# EAGLE design final-board (EAGLE 9.6.1)
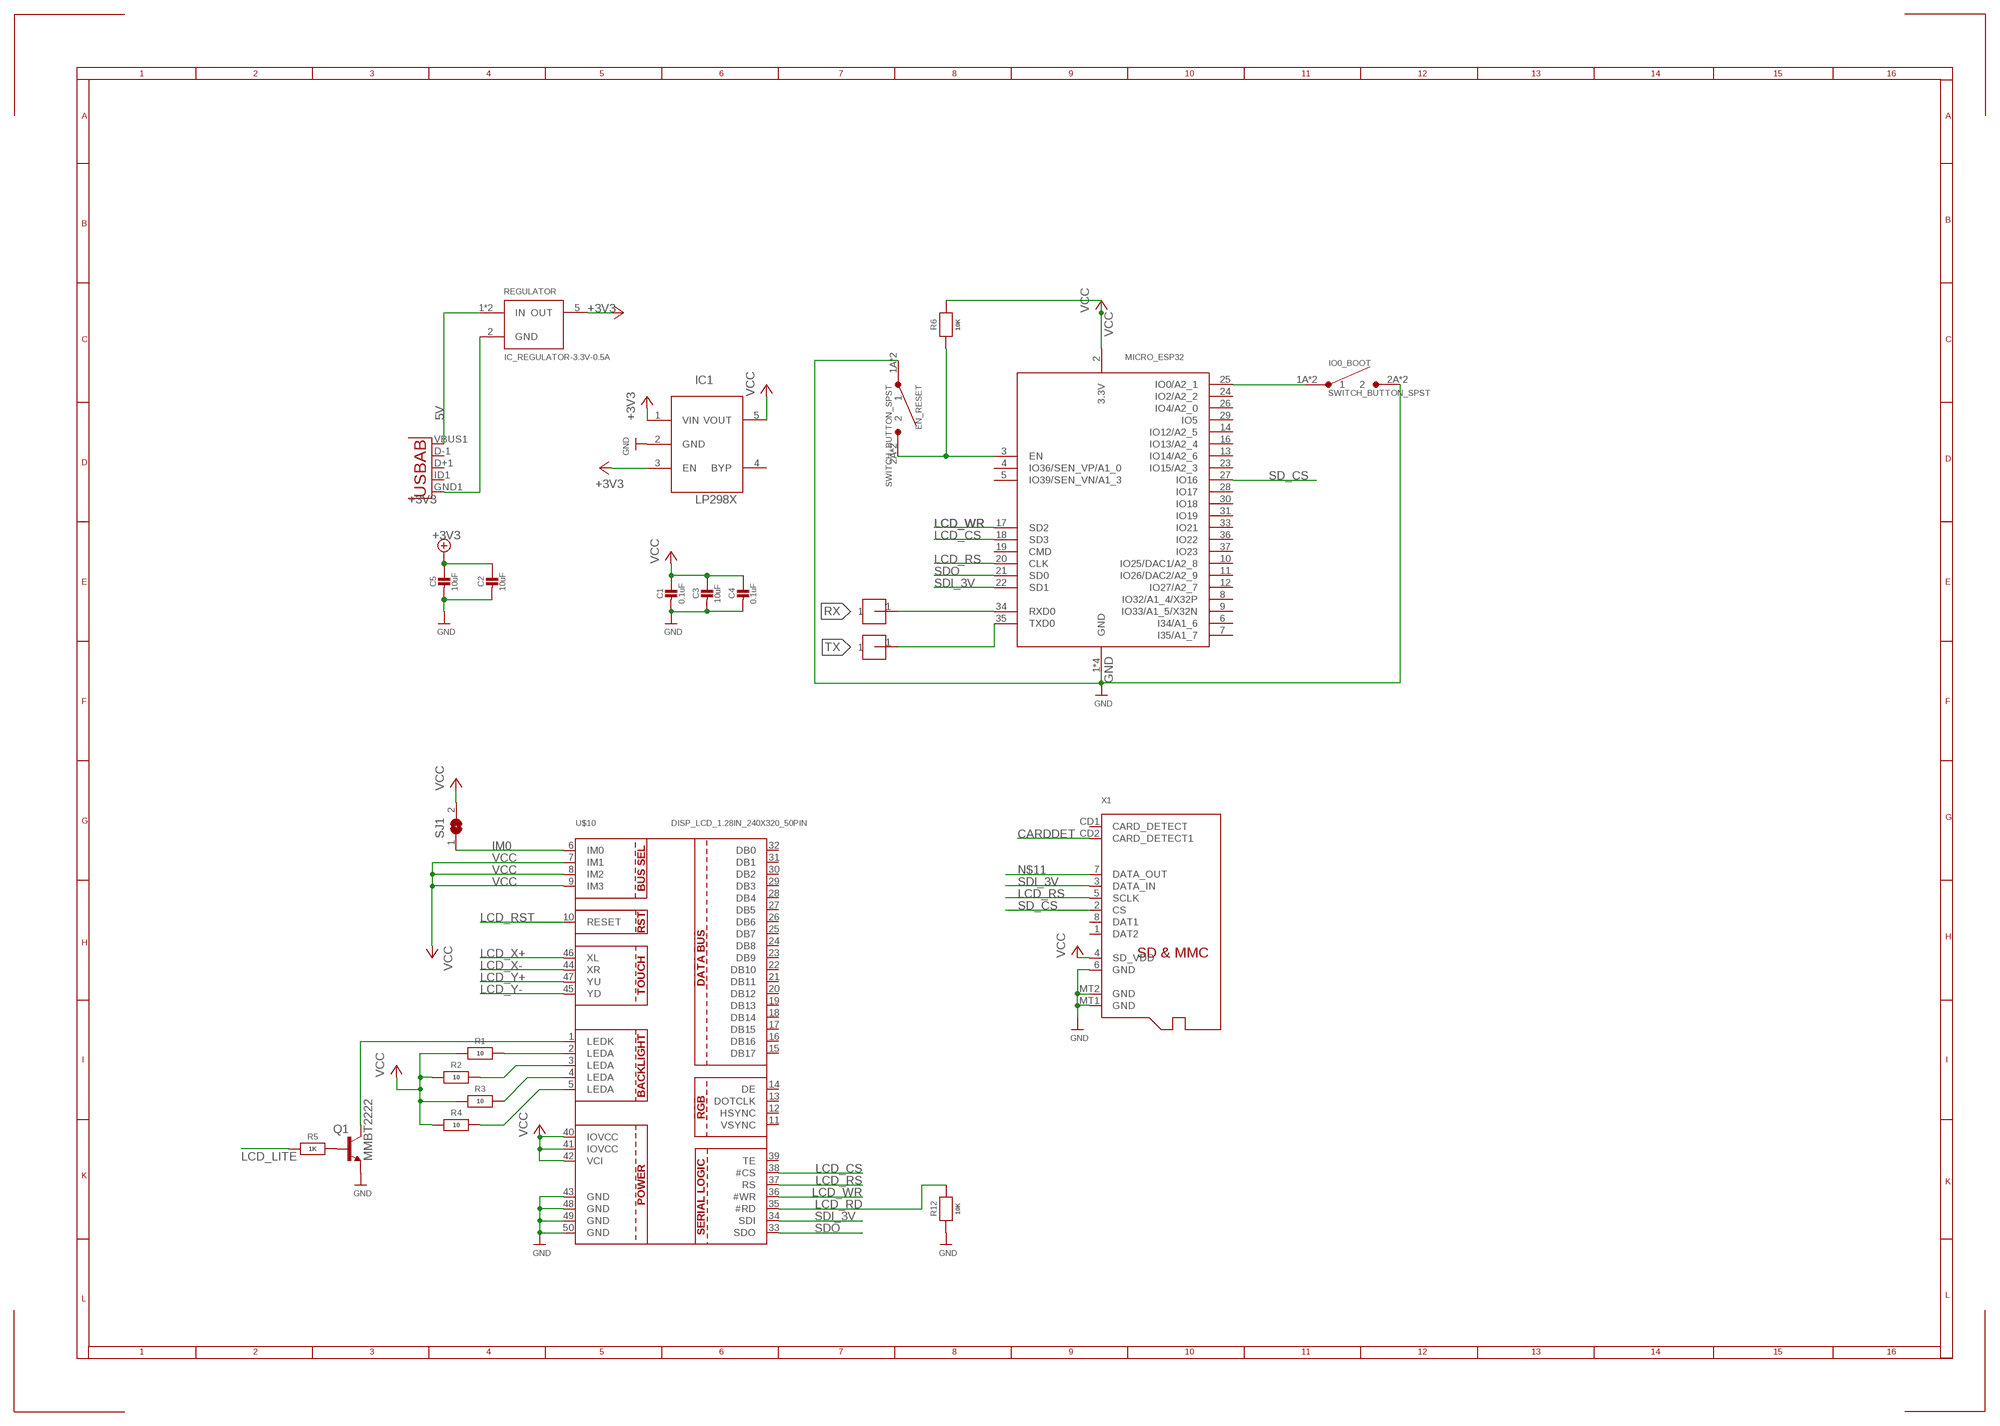
[diagram p0: schematic, sheet 1]

## Parts
C1  0.1uF  CAP_CERAMIC0805-NOOUTLINE  [0805-NO]
C2  10uF  CAP_CERAMIC0805-NOOUTLINE  [0805-NO]
C3  10uF  CAP_CERAMIC0805-NOOUTLINE  [0805-NO]
C4  0.1uF  CAP_CERAMIC0805-NOOUTLINE  [0805-NO]
C5  10uF  CAP_CERAMIC0805-NOOUTLINE  [0805-NO]
EN_RESET  SWITCH_BUTTON_SPST  [7914G-1-000E]
ESP_32  MICRO_ESP32  [WROOM32]
IC1  MIC5225-3.3  LP298XS  [SOT23-5L]
IO0_BOOT  SWITCH_BUTTON_SPST  [7914G-1-000E]
Q1  MMBT2222  MMBT2222ALT1-NPN-SOT23-BEC  [SOT23-BEC]
R1  10  RESISTOR0805_NOOUTLINE  [0805-NO]
R2  10  RESISTOR0805_NOOUTLINE  [0805-NO]
R3  10  RESISTOR0805_NOOUTLINE  [0805-NO]
R4  10  RESISTOR0805_NOOUTLINE  [0805-NO]
R5  1K  RESISTOR0805_NOOUTLINE  [0805-NO]
R6  10K  RESISTOR0805_NOOUTLINE  [0805-NO]
R12  10K  RESISTOR0805_NOOUTLINE  [0805-NO]
REGULATOR  IC_REGULATOR-3.3V-0.5A  [SOT23-5]
SJ1  SOLDERJUMPER  [SOLDERJUMPER_ARROW_NOPASTE]
U$2  HEADER-1-TESTPOINT  [TESTPOINT-1]
U$7  HEADER-1-TESTPOINT  [TESTPOINT-1]
U$10  DISP_LCD_1.28IN_240X320_50PIN  [TFT_2.83IN_240X320_50PIN]
USB  USB""  [USB-MICRO-SMD]
X1  MICROSD  [MICROSD]

## Nets
5V: REGULATOR.1(IN) REGULATOR.3(IN) USB.VBUS1(VBUS)
+3V3: C2.1 C5.1 IC1.1(VIN) IC1.3(EN) REGULATOR.5(OUT) ; supply symbol labelled +5V
CARDDET: X1.CD2(CARD_DETECT1)
GND: C1.2 C2.2 C3.2 C4.2 C5.2 EN_RESET.1A EN_RESET.1B ESP_32.1(GND) ESP_32.15(GND) ESP_32.38(GND) ESP_32.P$1(GND) IC1.2(GND) IO0_BOOT.2A IO0_BOOT.2B Q1.E R12.1 REGULATOR.2(GND) U$10.43(GND) U$10.48(GND) U$10.49(GND) U$10.50(GND) USB.GND1(GND) X1.6(GND) X1.MT1(GND) X1.MT2(GND)
IM0: SJ1.1 U$10.6(IM0)
LCD_CS: ESP_32.18(SD3) U$10.38(#CS)
LCD_LITE: R5.1
LCD_RD: R12.2 U$10.35(#RD)
LCD_RS: ESP_32.20(CLK) U$10.37(RS) X1.5(SCLK)
LCD_RST: U$10.10(RESET)
LCD_WR: ESP_32.17(SD2) U$10.36(#WR)
LCD_X+: U$10.46(XL)
LCD_X-: U$10.44(XR)
LCD_Y+: U$10.47(YU)
LCD_Y-: U$10.45(YD)
N$1: R4.2 U$10.5(LEDA)
N$2: R1.2 U$10.2(LEDA)
N$3: R2.2 U$10.3(LEDA)
N$4: R3.2 U$10.4(LEDA)
N$5: Q1.C U$10.1(LEDK)
N$6: EN_RESET.2A EN_RESET.2B ESP_32.3(EN) R6.1
N$7: ESP_32.25(IO0/A2_1) IO0_BOOT.1A IO0_BOOT.1B
N$11: X1.7(DATA_OUT)
N$16: Q1.B R5.2
RX: ESP_32.34(RXD0) U$2.1
SD_CS: ESP_32.27(IO16) X1.2(CS)
SDI_3V: ESP_32.22(SD1) U$10.34(SDI) X1.3(DATA_IN)
SDO: ESP_32.21(SD0) U$10.33(SDO)
TX: ESP_32.35(TXD0) U$7.1
VCC: C1.1 C3.1 C4.1 ESP_32.2(3.3V) IC1.5(VOUT) R1.1 R2.1 R3.1 R4.1 R6.2 SJ1.2 U$10.7(IM1) U$10.8(IM2) U$10.9(IM3) U$10.40(IOVCC) U$10.41(IOVCC) U$10.42(VCI) X1.4(SD_VDD)
Unconnected: ESP_32.4(IO36/SEN_VP/A1_0) ESP_32.5(IO39/SEN_VN/A1_3) ESP_32.6(I34/A1_6) ESP_32.7(I35/A1_7) ESP_32.8(IO32/A1_4/X32P) ESP_32.9(IO33/A1_5/X32N) ESP_32.10(IO25/DAC1/A2_8) ESP_32.11(IO26/DAC2/A2_9) ESP_32.12(IO27/A2_7) ESP_32.13(IO14/A2_6) ESP_32.14(IO12/A2_5) ESP_32.16(IO13/A2_4) ESP_32.19(CMD) ESP_32.23(IO15/A2_3) ESP_32.24(IO2/A2_2) ESP_32.26(IO4/A2_0) ESP_32.28(IO17) ESP_32.29(IO5) ESP_32.30(IO18) ESP_32.31(IO19) ESP_32.33(IO21) ESP_32.36(IO22) ESP_32.37(IO23) IC1.4(BYP) U$10.11(VSYNC) U$10.12(HSYNC) U$10.13(DOTCLK) U$10.14(DE) U$10.15(DB17) U$10.16(DB16) U$10.17(DB15) U$10.18(DB14) U$10.19(DB13) U$10.20(DB12) U$10.21(DB11) U$10.22(DB10) U$10.23(DB9) U$10.24(DB8) U$10.25(DB7) U$10.26(DB6) U$10.27(DB5) U$10.28(DB4) U$10.29(DB3) U$10.30(DB2) U$10.31(DB1) U$10.32(DB0) U$10.39(TE) USB.D+1(D+) USB.D-1(D-) USB.ID1(USBID) X1.1(DAT2) X1.8(DAT1) X1.CD1(CARD_DETECT)

## Library data of the parts
C1-C5 = microbuilder:CAP_CERAMIC: Ceramic Capacitors For new designs, use the packages preceded by an '_' character since they are more reliable: The following footprints should be used on most boards: _0402 - Standard footprint for regular board layouts _0603 - Standard footprint for regular board layouts _0805 - Standard footprint for regular board layouts _1206 - Standard footprint for regular board layouts For extremely tight-pitch boards where space is at a premium, the following 'micro-pitch' footprints can be used (smaller pads, no silkscreen outline, etc.): _0402MP - Micro-pitch footprint for very dense/compact boards _0603MP - Micro-pitch footprint for very dense/compact boards _0805MP - Micro-pitch footprint for very dense/compact boards _1206MP - Micro-pitch footprint for very dense/compact boards
EN_RESET IO0_BOOT = homemade-hardware:SWITCH_BUTTON_SPST: 7914G-1-000E <https://www.digikey.com/product-detail/en/bourns-inc/7914G-1-000E/7914G-000EDKR-ND/741386>: Momentary Button; HEIGHT: 4.2; PN: 7914G-1-000E
ESP_32 = homemade-hardware:MICRO_ESP32: WROOM-32 <https://www.digikey.com/products/en/rf-if-and-rfid/rf-transceiver-modules/872?k=wroom+32&k=&pkeyword=wroom+32&sv=0&v=1528&sf=1&FV=fffc05f8%2Cfffc0770%2C1f140000%2Cffe00368%2Cf60450e%2Cf604b7b%2Cf604b7c&quantity=&ColumnSort=0&page=1&stock=1&pageSize=25>: ESP32 Module
IC1 = adafruit:LP298X
Q1 = transistor-neu-to92:*-NPN-: NPN Transistror
R1-R6 R12 = microbuilder:RESISTOR: Resistors For new designs, use the packages preceded by an '_' character since they are more reliable: The following footprints should be used on most boards: _0402 - Standard footprint for regular board layouts _0603 - Standard footprint for regular board layouts _0805 - Standard footprint for regular board layouts _1206 - Standard footprint for regular board layouts For extremely tight-pitch boards where space is at a premium, the following 'micro-pitch' footprints can be used (smaller pads, no silkscreen outline, etc.): _0402MP - Micro-pitch footprint for very dense/compact boards _0603MP - Micro-pitch footprint for very dense/compact boards _0805MP - Micro-pitch footprint for very dense/compact boards _1206MP - Micro-pitch footprint for very dense/compact boards
REGULATOR = homemade-hardware:IC_REGULATOR: SPX3819M5-L-5-0/TR <https://www.digikey.com/product-detail/en/maxlinear-inc/SPX3819M5-L-5-0-TR/1016-1874-6-ND/3586704>: 5.0V/0.5A SMD Linear Regulator SPX3819M5-L-3-3/TR <https://www.digikey.com/product-detail/en/maxlinear-inc/SPX3819M5-L-3-3-TR/1016-1873-6-ND/3586703>: 3.3V/0.5A SMD Linear Regulator; PN: SPX3819M5-L-3-3/TR
SJ1 = microbuilder:SOLDERJUMPER: SMD Solder JUMPER Solder the two pads together to create a connection, or remove the solder to break it. REFLOW - Use this footprint for solder paste and reflow ovens. WAVE - Use this footprint for hand-soldering (larger pads). CLOSED - Has a trace between the two pads to ensure it is closed by default. The trace needs to be cut to disable the jumper, and can be closed again by creating a solder bridge between the two pads.; BOM: EXCLUDE
U$2 U$7 = homemade-hardware:HEADER-1: M20-8890845 <https://www.digikey.com/products/en?keywords=952-3236-ND>: Horizontal Male SMD Headers M20-7910842R <https://www.digikey.com/product-detail/en/harwin-inc/M20-7910842R/952-3200-6-ND/6559341>: Horizontal Female SMD Headers
U$10 = microbuilder:DISP_LCD_1.28IN_240X320_50PIN
USB = MicroUSB2:USB: This is a USB AB connector that is compatible with USB OTG. i.e. this connector can serve as a host or device
X1 = microbuilder:MICROSD: MicroSD/Transflash Card Holder with SPI pinout 3M: 2908-05WB-MG 4UConnector: 19656 Footprint courtesy: Adafruit Industries

## Board
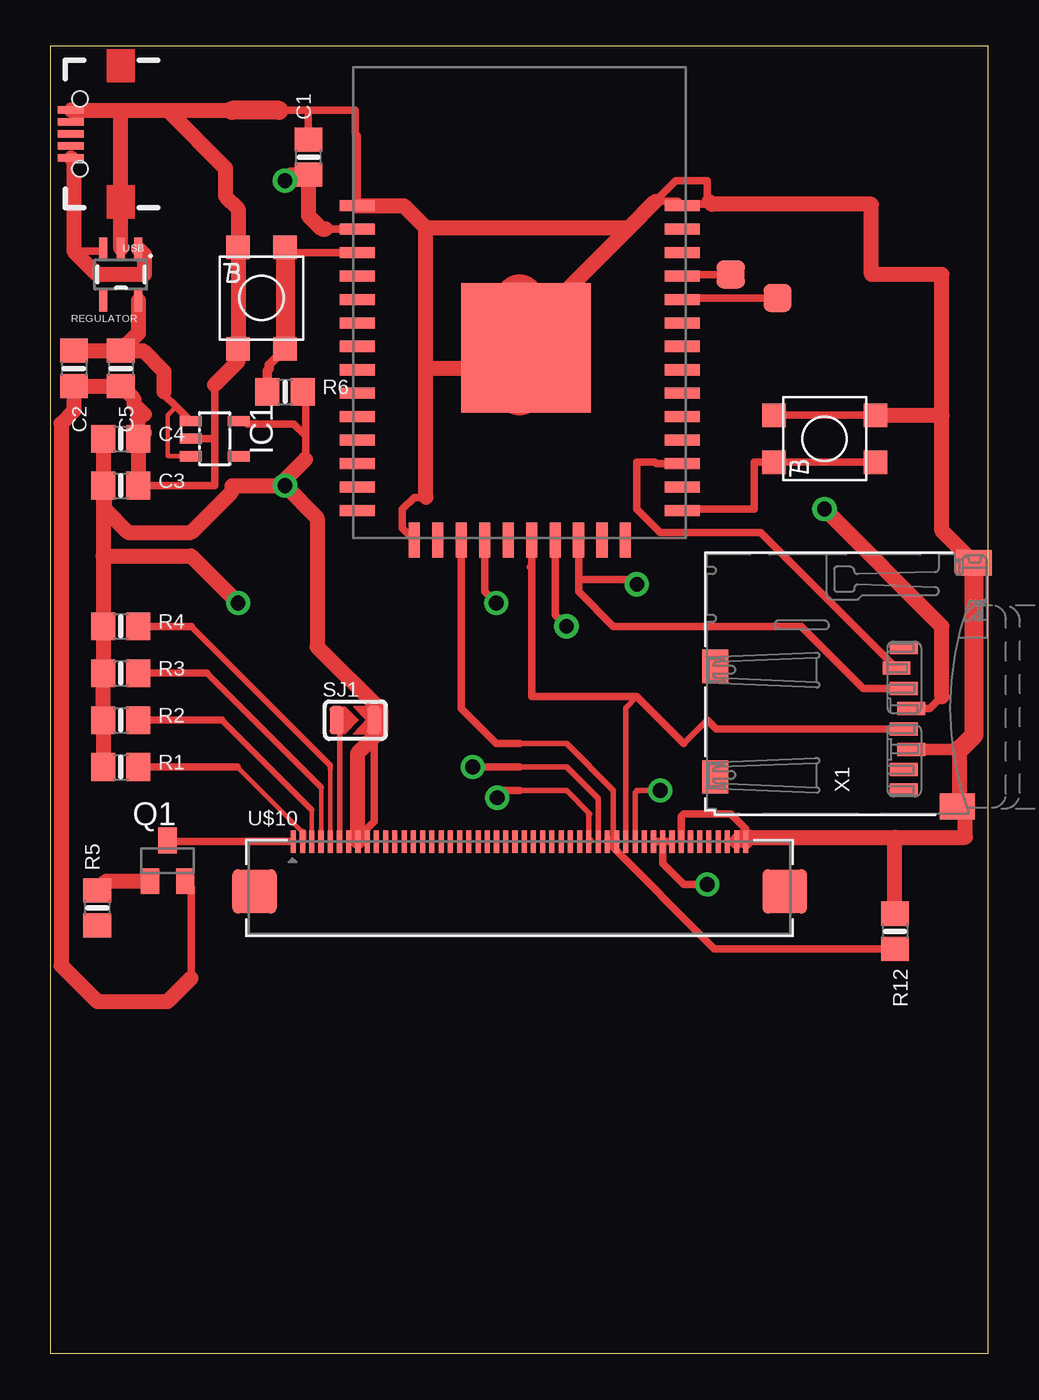
[diagram p1: board, top side]
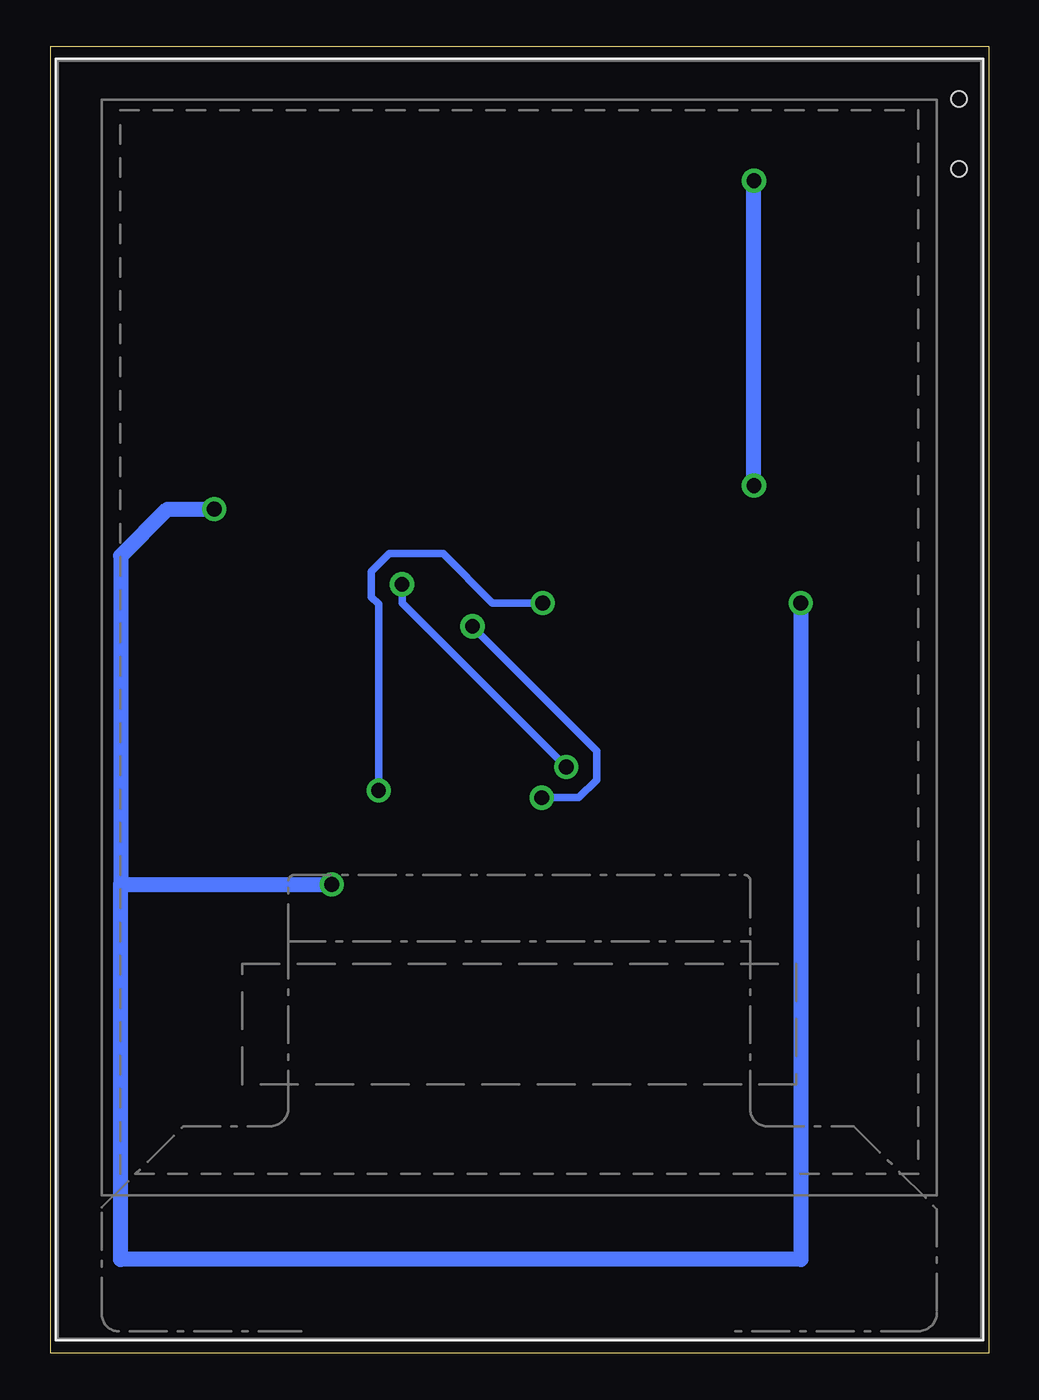
[diagram p2: board, bottom side, seen from below]

Size 50.78 x 70.79 mm. Coordinates in mm from the lower left corner, seen from the top.
Outline: 0,0 50.78,0 50.78,70.79 0,70.79 0,0
Copper layers (1*16): Top 0.035mm / dielectric 1.5mm / Bottom 0.035mm
Design rules "default": minimum track width 16mil, minimum drill 0.8mm, track to track 0.8mm, track to pad 0.8mm, pad to pad 0.8mm, via to via 0.8mm, smd to smd 0mil, copper to edge 1mil, drill to drill 1mil, minimum pad ring 10mil, minimum via ring 10mil, stop-mask expansion 1mil, vias tented up to drill 30mil, thermal gap 10mil

### Footprints (pad centres in the part's own frame; a part is rotated, then mirrored left to right if it is on the bottom)
0805-NO = smd 1.3 x 1.5: 1 -0.95,0; 2 0.95,0
7914G-1-000E = smd 1.27 x 1.27: 1A -1.27,2.75; 1B -1.27,-2.75; 2A 1.27,2.75; 2B 1.27,-2.75
WROOM32 = smd 1.9 x 0.6: 1 -8.8,5; 2 -8.8,3.73; 3 -8.8,2.46; 4 -8.8,1.19; 5 -8.8,-0.08; 6 -8.8,-1.35; 7 -8.8,-2.62; 8 -8.8,-3.89; 9 -8.8,-5.16; 10 -8.8,-6.43; 11 -8.8,-7.7; 12 -8.8,-8.97; 13 -8.8,-10.24; 14 -8.8,-11.51; 25 8.8,-11.51; 26 8.8,-10.24; 27 8.8,-8.97; 28 8.8,-7.7; 29 8.8,-6.43; 30 8.8,-5.16; 31 8.8,-3.89; 32 8.8,-2.62; 33 8.8,-1.35; 34 8.8,-0.08; 35 8.8,1.19; 36 8.8,2.46; 37 8.8,3.73; 38 8.8,5 | smd 0.6 x 1.9: 15 -5.7,-13.1; 16 -4.43,-13.1; 17 -3.16,-13.1; 18 -1.89,-13.1; 19 -0.62,-13.1; 20 0.65,-13.1; 21 1.92,-13.1; 22 3.19,-13.1; 23 4.46,-13.1; 24 5.73,-13.1 | smd 7 x 7: P$1 0.34,-2.7
SOT23-5L = smd 0.55 x 1.2: 1 -0.95,-1.3; 2 0,-1.3; 3 0.95,-1.3; 4 0.95,1.3; 5 -0.95,1.3
SOT23-BEC = smd 1 x 1.4: B -0.95,-1.1; C 0,1.1; E 0.95,-1.1
SOT23-5 = smd 0.45 x 1.2: 1 -0.95,-1.4; 2 0,-1.4; 3 0.95,-1.4; 4 0.95,1.4; 5 -0.95,1.4
SOLDERJUMPER_ARROW_NOPASTE = smd 0.762 x 1.524: 1 -1.016,0; 2 1.016,0
TESTPOINT-1 = smd 1.524 x 1.524: 1 0,0
TFT_2.83IN_240X320_50PIN = smd 0.275 x 1.2 bottom: 1 12.25,-10.39; 2 11.75,-10.39; 3 11.25,-10.39; 4 10.75,-10.39; 5 10.25,-10.39; 6 9.75,-10.39; 7 9.25,-10.39; 8 8.75,-10.39; 9 8.25,-10.39; 10 7.75,-10.39; 11 7.25,-10.39; 12 6.75,-10.39; 13 6.25,-10.39; 14 5.75,-10.39; 15 5.25,-10.39; 16 4.75,-10.39; 17 4.25,-10.39; 18 3.75,-10.39; 19 3.25,-10.39; 20 2.75,-10.39; 21 2.25,-10.39; 22 1.75,-10.39; 23 1.25,-10.39; 24 0.75,-10.39; 25 0.25,-10.39; 26 -0.25,-10.39; 27 -0.75,-10.39; 28 -1.25,-10.39; 29 -1.75,-10.39; 30 -2.25,-10.39; 31 -2.75,-10.39; 32 -3.25,-10.39; 33 -3.75,-10.39; 34 -4.25,-10.39; 35 -4.75,-10.39; 36 -5.25,-10.39; 37 -5.75,-10.39; 38 -6.25,-10.39; 39 -6.75,-10.39; 40 -7.25,-10.39; 41 -7.75,-10.39; 42 -8.25,-10.39; 43 -8.75,-10.39; 44 -9.25,-10.39; 45 -9.75,-10.39; 46 -10.25,-10.39; 47 -10.75,-10.39; 48 -11.25,-10.39; 49 -11.75,-10.39; 50 -12.25,-10.39 | smd 2.4 x 2.4 bottom: PAD1 14.35,-13.09; PAD2 -14.35,-13.09
USB-MICRO-SMD = smd 1.4 x 0.4: D+1 2.7,0; D-1 2.7,0.65; GND1 2.7,-1.3; ID1 2.7,-0.65; VBUS1 2.7,1.3 | hole 0.85: 2.2,1.9; 2.2,-1.9
MICROSD = smd 0.7 x 1.5: 1 9,-10.64; 2 7.9,-10.24; 3 6.8,-10.64; 4 5.7,-11.04; 5 4.6,-10.64; 6 3.5,-11.04; 7 2.4,-10.64; 8 1.3,-10.64 | smd 1.8 x 1.4: CD1 2,-0.44; CD2 8,-0.44 | smd 1.4 x 1.9: MT1 0.4,-13.54; MT2 13.6,-14.44

### Placement (x,y rotation side)
C1  13.97,64.77 90 top
C2  1.27,53.34 270 top
C3  3.81,46.99 0 top
C4  3.81,49.53 0 top
C5  3.81,53.34 270 top
EN_RESET  11.43,57.15 0 top
ESP_32  25.4,57.15 0 top
IC1  8.89,49.53 270 top
IO0_BOOT  41.91,49.53 90 top
Q1  6.35,26.67 0 top
R1  3.81,31.75 0 top
R2  3.81,34.29 0 top
R3  3.81,36.83 0 top
R4  3.81,39.37 0 top
R5  2.54,24.13 90 top
R6  12.7,52.07 0 top
R12  45.72,22.86 270 top
REGULATOR  3.81,58.42 180 top
SJ1  16.51,34.29 0 top
U$2  39.37,57.15 0 top
U$7  36.83,58.42 0 top
U$10  25.4,38.1 0 bottom
USB  3.81,66.04 180 top
X1  35.56,29.21 90 top

### Tracks (layer width: path | path; a pad name or v marks a point on that pad's centre or on a via)
5V
  Top 0.406: REGULATOR.3 2.73,59.69 1.27,59.69
  Top 0.813: USB.VBUS1 1.27,64.58 1.27,59.69 2.54,58.42 5.08,58.42 5.08,59.5 REGULATOR.1
+3V3
  Top 0.254: IC1.3 6.35,48.58 6.35,50.8 6.81,51.26
  Top 0.406: IC1.1 6.81,51.26 6.14,51.93 6.14,52.07
  Top 0.813: C2.1 C5.1 | REGULATOR.5 4.76,55.24 C5.1 | C5.1 5.02,54.29 6.14,53.17 6.14,52.07
GND
  Top 0.406: IO0_BOOT.2A IO0_BOOT.2B | 16.51,62.24 ESP_32.1 16.6,65.95 16.51,66.04 16.51,67.31 13.97,67.31 | X1.MT1 49.22,29.73 49.22,30.48 | U$10.48 U$10.49 | IC1.2 8.89,49.53 | 8.89,49.53 8.89,46.99 C3.2 | 8.89,49.53 8.89,52.46 | U$10.43 34.15,29.07 34.29,29.21 36.83,29.21 37.65,28.39 U$10.50 | ESP_32.15 19.05,44.7 19.05,45.72 19.69,46.36 20.32,46.36 | Q1.E 7.62,25.25 7.62,20.32 | 34.12,62.23 34.17,62.18 34.2,62.18 | 34.12,62.23 33.96,62.39 32.75,62.39 33.86,63.5 35.56,63.5 35.56,62.48 35.81,62.23 34.28,62.23 | 34.28,62.23 34.12,62.23 | ESP_32.38 34.28,62.23 | C1.2 13.97,67.31 | 13.97,67.31 12.38,67.31
  Top 0.61: 8.89,52.46 8.89,52.32 | X1.6 49.22,32.71
  Top 0.813: X1.MT2 48.26,44.55 48.26,50.8 | 48.26,50.8 48.26,58.42 44.45,58.42 44.45,62.23 35.81,62.23 35.65,62.39 | USB.GND1 1.14,67.31 3.81,67.31 | 3.81,67.31 6.35,67.31 | 6.35,67.31 9.84,67.31 | REGULATOR.2 3.81,67.31 | 4.76,51.17 5.08,50.85 | 5.08,49.85 C4.2 | C4.2 C3.2 | 6.35,67.31 9.47,64.19 9.47,62.67 10.16,61.98 EN_RESET.1A EN_RESET.1B 10.16,53.73 8.89,52.46 | C4.2 4.76,51.17 | 4.76,51.17 4.53,51.4 4.53,51.67 C5.2 C2.2 1.27,51.05 0.58,50.36 0.58,21.01 2.54,19.05 6.35,19.05 7.62,20.32 | IO0_BOOT.2B 48.26,50.8 | ESP_32.1 19.13,62.15 20.32,60.96 | 49.22,30.48 49.22,32.71 | U$10.50 37.88,27.94 | 37.88,27.94 45.72,27.94 | 45.72,27.94 49.53,27.94 49.53,29.18 X1.MT1 | U$10.49 37.38,27.94 37.88,27.94 | 20.32,46.36 20.32,53.34 | 20.32,53.34 20.32,60.96 | 20.32,60.96 31.32,60.96 | 31.32,60.96 32.75,62.39 | 24.63,53.34 26.67,53.34 | ESP_32.P$1 24.63,53.34 | 24.63,53.34 20.32,53.34 | 31.32,60.96 26.24,55.88 25.4,55.88 | R12.1 45.72,27.94
  Top 1.016: 12.38,67.31 9.84,67.31 | X1.MT2 50,33.49 49.22,32.71
  Top 2.54: 25.4,52.07 25.4,55.88 25.4,57.15
IM0
  Top 0.305: U$10.6 15.65,34.13
  Top 0.406: 15.65,34.13 SJ1.1
LCD_CS  (via drill 0.8)
  Top 0.305: U$10.38 31.65,30.38 31.75,30.48 v33.02,30.48
  Top 0.406: v24.13,40.64 23.51,41.26 23.51,41.91 23.51,42.65 ESP_32.18
  Bottom 0.406: v33.02,30.48 33.02,40.57 33.41,40.96 33.41,42.33 32.44,43.3 29.53,43.3 26.87,40.64 v24.13,40.64
LCD_RD
  Top 0.406: R12.2 35.95,21.91 U$10.35
LCD_RS
  Top 0.305: 34.29,33.02 35.56,34.29 | U$10.37 31.15,34.29 31.15,34.96 31.75,35.56
  Top 0.406: X1.5 36.04,33.81 35.56,34.29 | 34.29,33.02 31.75,35.56 26.05,35.56 26.05,42.65 | 26.05,42.65 25.99,42.59 | ESP_32.20 26.05,42.65
LCD_WR
  Top 0.305: 30.48,27.88 30.48,30.48 27.94,33.02 25.4,33.02
  Top 0.406: U$10.36 30.48,27.88 | ESP_32.17 22.24,34.91 24.13,33.02 25.4,33.02
N$1
  Top 0.254: U$10.5 15.15,31.66
  Top 0.305: 15.15,31.66 15.15,31.84 7.62,39.37
  Top 0.406: 7.62,39.37 R4.2
N$2
  Top 0.254: 13.65,28.22 10.12,31.75
  Top 0.406: 10.12,31.75 R1.2 | U$10.2 13.65,28.22
N$3
  Top 0.254: U$10.3 14.15,29.43
  Top 0.305: 14.15,29.43 9.29,34.29
  Top 0.406: 9.29,34.29 R2.2
N$4
  Top 0.254: U$10.4 14.65,30.63
  Top 0.305: 14.65,30.63 8.45,36.83
  Top 0.406: 8.45,36.83 R3.2
N$5
  Top 0.406: U$10.1 6.41,27.71 Q1.C
N$6
  Top 0.406: ESP_32.3 12.99,59.61 EN_RESET.2A
  Top 0.508: R6.1 11.75,53.23 11.85,53.33 11.85,53.55 EN_RESET.2B
  Top 1.016: EN_RESET.2A EN_RESET.2B
N$7
  Top 0.406: ESP_32.25 34.28,45.72 38.1,45.72 38.1,48.26 IO0_BOOT.1A IO0_BOOT.1B
N$16
  Top 0.813: R5.2 3.03,25.57 Q1.B
RX
  Top 0.406: ESP_32.34 34.28,57.15 U$2.1
SD_CS
  Top 0.406: X1.2 38.46,44.45 33.02,44.45 31.75,45.72 31.75,48.26 32.72,48.26 32.8,48.18 ESP_32.27
SDI_3V  (via drill 0.8)
  Top 0.305: U$10.34 29.65,30.04 27.94,31.75 25.4,31.75
  Top 0.406: ESP_32.22 28.59,41.91 | 28.59,41.91 28.59,41.26 30.48,39.37 40.64,39.37 44,36.01 X1.3 | 25.4,31.75 v22.86,31.75 | v31.75,41.65 31.49,41.91 28.59,41.91
  Bottom 0.406: v22.86,31.75 31.75,40.64 v31.75,41.65 31.75,41.91
SDO  (via drill 0.8)
  Top 0.254: 29.15,29.15 29.21,29.21
  Top 0.305: U$10.33 29.15,29.15 | 25.4,30.48 27.94,30.48 29.21,29.21
  Top 0.406: U$10.33 29.21,27.77 | v27.94,39.37 27.32,39.99 ESP_32.21 | v24.18,30.09 24.57,30.48 25.4,30.48
  Bottom 0.406: v24.18,30.09 22.17,30.09 21.2,31.06 21.2,32.63 v27.94,39.37
TX
  Top 0.406: ESP_32.35 34.28,58.42 U$7.1
VCC  (via drill 0.8)
  Top 0.406: ESP_32.2 14.7,60.88 | SJ1.2 17.53,28.82 16.65,27.94 | U$10.42 U$10.41 | U$10.41 U$10.40 | X1.4 47.61,34.91 48.26,35.56 | U$10.41 33.15,26.54 34.29,25.4 v35.56,25.4 | IC1.5 10.52,50.48 10.68,50.32 13.18,50.32 13.81,49.69 | 13.65,48.58 13.81,48.42 13.81,49.69 | U$10.9 U$10.7 U$10.8 | 13.81,49.69 13.81,51.91 R6.2
  Top 0.813: C4.1 C3.1 | C3.1 2.86,43.18 | 2.86,43.18 R4.1 R3.1 R2.1 R1.1 | C3.1 2.9,46.95 2.9,45.74 4.19,44.45 7.62,44.45 9.84,46.67 9.84,46.99 12.38,46.99 | 14.91,60.88 14.7,60.88 13.97,61.61 C1.1 13.02,63.82 v12.7,63.5 | 12.38,46.99 13.81,48.42 | 12.38,46.99 v12.7,46.99 14.44,45.25 14.44,38.26 17.91,34.8 17.91,33.78 16.65,32.52 16.65,27.94 U$10.8 | 2.86,43.18 7.62,43.18 v10.16,40.64 | v41.91,45.72 48.26,39.37 48.26,35.56
  Bottom 0.813: v12.7,46.99 v12.7,63.5 | v10.16,40.64 10.16,5.08 46.99,5.08 46.99,25.4 | 46.99,25.4 46.99,43.18 44.45,45.72 v41.91,45.72 | 46.99,25.4 v35.56,25.4